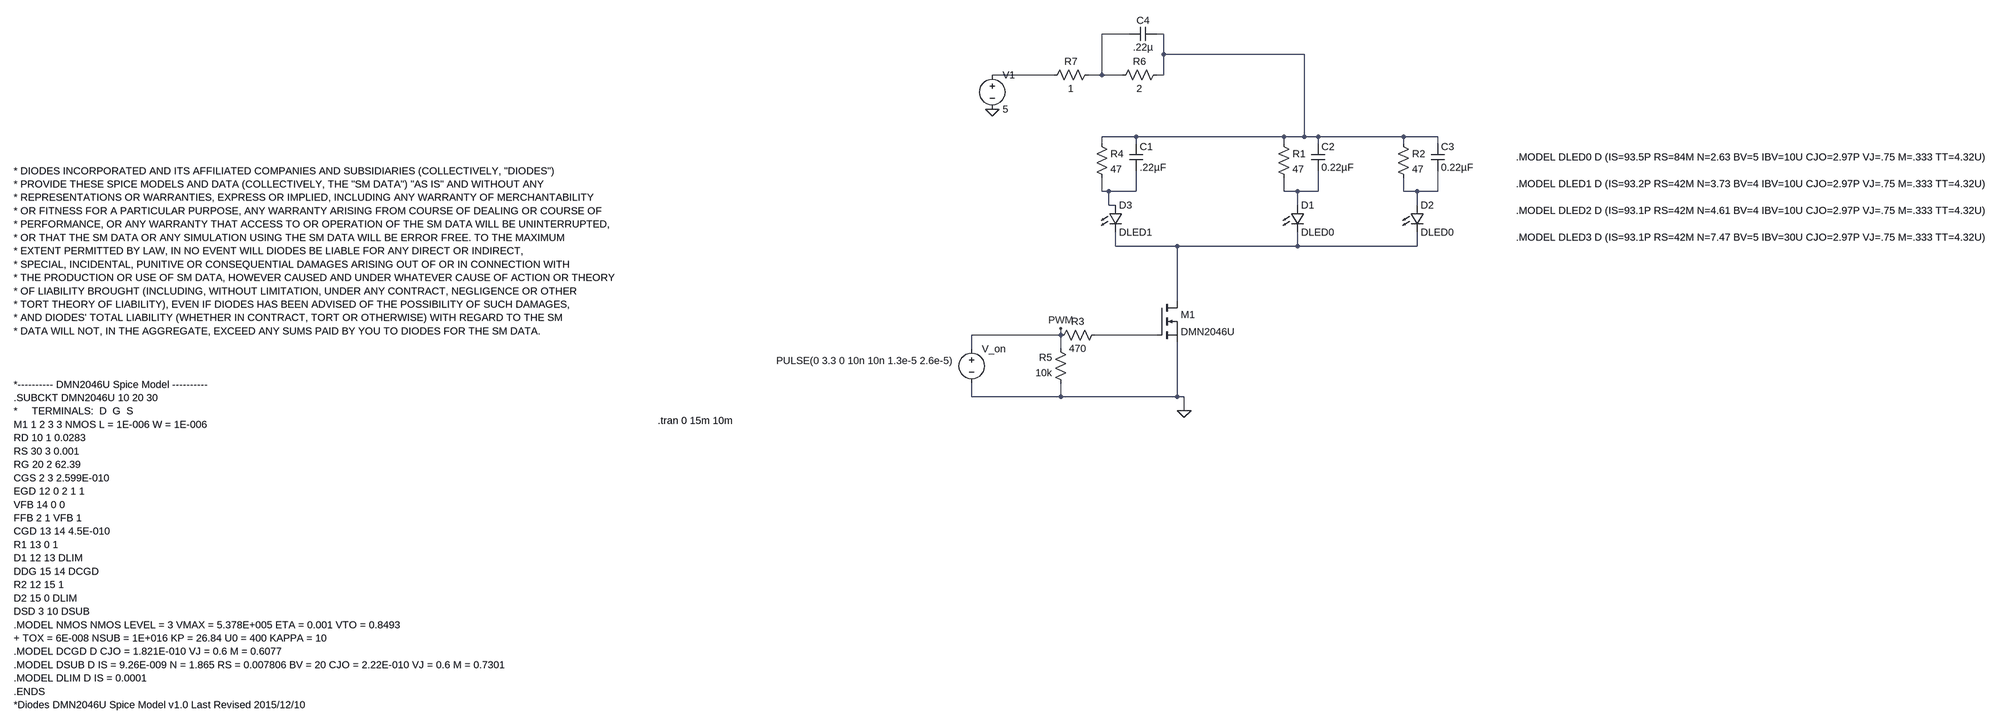
[diagram p0: schematic sim.asc]
sim.asc, the LTspice schematic file:
Version 4
SHEET 1 2612 976
WIRE 96 -480 32 -480
WIRE 176 -480 160 -480
WIRE 176 -432 176 -480
WIRE 528 -432 176 -432
WIRE -80 -384 -224 -384
WIRE 32 -384 32 -480
WIRE 32 -384 0 -384
WIRE 80 -384 32 -384
WIRE 176 -384 176 -432
WIRE 176 -384 160 -384
WIRE 112 -240 32 -240
WIRE 480 -240 112 -240
WIRE 528 -240 528 -432
WIRE 528 -240 480 -240
WIRE 560 -240 528 -240
WIRE 816 -240 560 -240
WIRE 896 -240 816 -240
WIRE 32 -224 32 -240
WIRE 112 -224 112 -240
WIRE 480 -224 480 -240
WIRE 560 -224 560 -240
WIRE 816 -224 816 -240
WIRE 896 -224 896 -240
WIRE 32 -112 32 -144
WIRE 48 -112 32 -112
WIRE 112 -112 112 -160
WIRE 112 -112 48 -112
WIRE 480 -112 480 -144
WIRE 512 -112 480 -112
WIRE 560 -112 560 -160
WIRE 560 -112 512 -112
WIRE 816 -112 816 -144
WIRE 848 -112 816 -112
WIRE 896 -112 896 -160
WIRE 896 -112 848 -112
WIRE 48 -80 48 -112
WIRE 64 -80 48 -80
WIRE 512 -80 512 -112
WIRE 848 -80 848 -112
WIRE 64 16 64 -16
WIRE 208 16 64 16
WIRE 512 16 512 -16
WIRE 512 16 208 16
WIRE 848 16 848 -16
WIRE 848 16 512 16
WIRE 208 144 208 16
WIRE -64 224 -64 208
WIRE -64 224 -272 224
WIRE 160 224 16 224
WIRE -272 256 -272 224
WIRE -64 256 -64 224
WIRE -272 368 -272 336
WIRE -64 368 -64 336
WIRE -64 368 -272 368
WIRE 208 368 208 240
WIRE 208 368 -64 368
WIRE 224 368 208 368
WIRE 224 400 224 368
FLAG 224 400 0
FLAG -224 -304 0
FLAG -64 208 PWM
SYMBOL res 464 -240 R0
SYMATTR InstName R1
SYMATTR Value 47
SYMBOL voltage -224 -400 R0
WINDOW 123 0 0 Left 0
WINDOW 39 0 0 Left 0
SYMATTR InstName V1
SYMATTR Value 5
SYMBOL res 32 208 R90
WINDOW 0 0 56 VBottom 2
WINDOW 3 32 56 VTop 2
SYMATTR InstName R3
SYMATTR Value 470
SYMBOL voltage -272 240 R0
WINDOW 3 -456 44 Left 2
WINDOW 123 0 0 Left 0
WINDOW 39 0 0 Left 0
SYMATTR Value PULSE(0 3.3 0 10n 10n 1.3e-5 2.6e-5)
SYMATTR InstName V_on
SYMBOL res 800 -240 R0
SYMATTR InstName R2
SYMATTR Value 47
SYMBOL LED 832 -80 R0
SYMATTR InstName D2
SYMATTR Value DLED0
SYMATTR Description Diode
SYMATTR Type diode
SYMBOL res 16 -240 R0
SYMATTR InstName R4
SYMATTR Value 47
SYMBOL res -48 352 R180
WINDOW 0 36 76 Left 2
WINDOW 3 36 40 Left 2
SYMATTR InstName R5
SYMATTR Value 10k
SYMBOL cap 96 -224 R0
SYMATTR InstName C1
SYMATTR Value .22µF
SYMBOL cap 544 -224 R0
SYMATTR InstName C2
SYMATTR Value 0.22µF
SYMBOL cap 880 -224 R0
SYMATTR InstName C3
SYMATTR Value 0.22µF
SYMBOL res 176 -400 R90
WINDOW 0 0 56 VBottom 2
WINDOW 3 32 56 VTop 2
SYMATTR InstName R6
SYMATTR Value 2
SYMBOL cap 160 -496 R90
WINDOW 0 0 32 VBottom 2
WINDOW 3 32 32 VTop 2
SYMATTR InstName C4
SYMATTR Value .22µ
SYMBOL res 16 -400 R90
WINDOW 0 0 56 VBottom 2
WINDOW 3 32 56 VTop 2
SYMATTR InstName R7
SYMATTR Value 1
SYMBOL nmos 160 144 R0
SYMATTR InstName M1
SYMATTR Value DMN2046U
SYMATTR Prefix X
SYMATTR SpiceModel DMN2046U
SYMBOL LED 496 -80 R0
SYMATTR InstName D1
SYMATTR Value DLED0
SYMATTR Description Diode
SYMATTR Type diode
SYMBOL LED 48 -80 R0
SYMATTR InstName D3
SYMATTR Value DLED1
SYMATTR Description Diode
SYMATTR Type diode
TEXT -1128 424 Left 2 !.tran 0 15m 10m
TEXT -3128 -160 Left 2 !* DIODES INCORPORATED AND ITS AFFILIATED COMPANIES AND SUBSIDIARIES (COLLECTIVELY, "DIODES") \n* PROVIDE THESE SPICE MODELS AND DATA (COLLECTIVELY, THE "SM DATA") "AS IS" AND WITHOUT ANY \n* REPRESENTATIONS OR WARRANTIES, EXPRESS OR IMPLIED, INCLUDING ANY WARRANTY OF MERCHANTABILITY \n* OR FITNESS FOR A PARTICULAR PURPOSE, ANY WARRANTY ARISING FROM COURSE OF DEALING OR COURSE OF \n* PERFORMANCE, OR ANY WARRANTY THAT ACCESS TO OR OPERATION OF THE SM DATA WILL BE UNINTERRUPTED, \n* OR THAT THE SM DATA OR ANY SIMULATION USING THE SM DATA WILL BE ERROR FREE. TO THE MAXIMUM \n* EXTENT PERMITTED BY LAW, IN NO EVENT WILL DIODES BE LIABLE FOR ANY DIRECT OR INDIRECT, \n* SPECIAL, INCIDENTAL, PUNITIVE OR CONSEQUENTIAL DAMAGES ARISING OUT OF OR IN CONNECTION WITH \n* THE PRODUCTION OR USE OF SM DATA, HOWEVER CAUSED AND UNDER WHATEVER CAUSE OF ACTION OR THEORY \n* OF LIABILITY BROUGHT (INCLUDING, WITHOUT LIMITATION, UNDER ANY CONTRACT, NEGLIGENCE OR OTHER \n* TORT THEORY OF LIABILITY), EVEN IF DIODES HAS BEEN ADVISED OF THE POSSIBILITY OF SUCH DAMAGES, \n* AND DIODES' TOTAL LIABILITY (WHETHER IN CONTRACT, TORT OR OTHERWISE) WITH REGARD TO THE SM \n* DATA WILL NOT, IN THE AGGREGATE, EXCEED ANY SUMS PAID BY YOU TO DIODES FOR THE SM DATA.\n \n \n \n*---------- DMN2046U Spice Model ----------\n.SUBCKT DMN2046U 10 20 30 \n*     TERMINALS:  D  G  S\nM1 1 2 3 3 NMOS L = 1E-006 W = 1E-006 \nRD 10 1 0.0283 \nRS 30 3 0.001 \nRG 20 2 62.39 \nCGS 2 3 2.599E-010 \nEGD 12 0 2 1 1 \nVFB 14 0 0 \nFFB 2 1 VFB 1 \nCGD 13 14 4.5E-010 \nR1 13 0 1 \nD1 12 13 DLIM \nDDG 15 14 DCGD \nR2 12 15 1 \nD2 15 0 DLIM \nDSD 3 10 DSUB \n.MODEL NMOS NMOS LEVEL = 3 VMAX = 5.378E+005 ETA = 0.001 VTO = 0.8493 \n+ TOX = 6E-008 NSUB = 1E+016 KP = 26.84 U0 = 400 KAPPA = 10 \n.MODEL DCGD D CJO = 1.821E-010 VJ = 0.6 M = 0.6077 \n.MODEL DSUB D IS = 9.26E-009 N = 1.865 RS = 0.007806 BV = 20 CJO = 2.22E-010 VJ = 0.6 M = 0.7301 \n.MODEL DLIM D IS = 0.0001 \n.ENDS\n*Diodes DMN2046U Spice Model v1.0 Last Revised 2015/12/10
TEXT 1152 -192 Left 2 !.MODEL DLED0 D (IS=93.5P RS=84M N=2.63 BV=5 IBV=10U CJO=2.97P VJ=.75 M=.333 TT=4.32U)\n \n.MODEL DLED1 D (IS=93.2P RS=42M N=3.73 BV=4 IBV=10U CJO=2.97P VJ=.75 M=.333 TT=4.32U)\n \n.MODEL DLED2 D (IS=93.1P RS=42M N=4.61 BV=4 IBV=10U CJO=2.97P VJ=.75 M=.333 TT=4.32U)\n \n.MODEL DLED3 D (IS=93.1P RS=42M N=7.47 BV=5 IBV=30U CJO=2.97P VJ=.75 M=.333 TT=4.32U)

The netlist it stands for:
* sim.asc
R1 N002 N005 47
V1 N003 0 5
R3 N008 PWM 470
V_on PWM 0 PULSE(0 3.3 0 10n 10n 1.3e-5 2.6e-5)
R2 N002 N006 47
D2 N006 N007 DLED0
R4 N002 N004 47
R5 0 PWM 10k
C1 N002 N004 .22µF
C2 N002 N005 0.22µF
C3 N002 N006 0.22µF
R6 N002 N001 2
C4 N002 N001 .22µ
R7 N001 N003 1
XM1 N007 N008 0 DMN2046U DMN2046U  ; pins D G S
D1 N005 N007 DLED0
D3 N004 N007 DLED1
.model D D
.lib standard.dio
.tran 0 15m 10m
* DIODES INCORPORATED AND ITS AFFILIATED COMPANIES AND SUBSIDIARIES (COLLECTIVELY, "DIODES")
* PROVIDE THESE SPICE MODELS AND DATA (COLLECTIVELY, THE "SM DATA") "AS IS" AND WITHOUT ANY
* REPRESENTATIONS OR WARRANTIES, EXPRESS OR IMPLIED, INCLUDING ANY WARRANTY OF MERCHANTABILITY
* OR FITNESS FOR A PARTICULAR PURPOSE, ANY WARRANTY ARISING FROM COURSE OF DEALING OR COURSE OF
* PERFORMANCE, OR ANY WARRANTY THAT ACCESS TO OR OPERATION OF THE SM DATA WILL BE UNINTERRUPTED,
* OR THAT THE SM DATA OR ANY SIMULATION USING THE SM DATA WILL BE ERROR FREE. TO THE MAXIMUM
* EXTENT PERMITTED BY LAW, IN NO EVENT WILL DIODES BE LIABLE FOR ANY DIRECT OR INDIRECT,
* SPECIAL, INCIDENTAL, PUNITIVE OR CONSEQUENTIAL DAMAGES ARISING OUT OF OR IN CONNECTION WITH
* THE PRODUCTION OR USE OF SM DATA, HOWEVER CAUSED AND UNDER WHATEVER CAUSE OF ACTION OR THEORY
* OF LIABILITY BROUGHT (INCLUDING, WITHOUT LIMITATION, UNDER ANY CONTRACT, NEGLIGENCE OR OTHER
* TORT THEORY OF LIABILITY), EVEN IF DIODES HAS BEEN ADVISED OF THE POSSIBILITY OF SUCH DAMAGES,
* AND DIODES' TOTAL LIABILITY (WHETHER IN CONTRACT, TORT OR OTHERWISE) WITH REGARD TO THE SM
* DATA WILL NOT, IN THE AGGREGATE, EXCEED ANY SUMS PAID BY YOU TO DIODES FOR THE SM DATA.
*---------- DMN2046U Spice Model ----------
.SUBCKT DMN2046U 10 20 30
*     TERMINALS:  D  G  S
M1 1 2 3 3 NMOS L = 1E-006 W = 1E-006
RD 10 1 0.0283
RS 30 3 0.001
RG 20 2 62.39
CGS 2 3 2.599E-010
EGD 12 0 2 1 1
VFB 14 0 0
FFB 2 1 VFB 1
CGD 13 14 4.5E-010
R1 13 0 1
D1 12 13 DLIM
DDG 15 14 DCGD
R2 12 15 1
D2 15 0 DLIM
DSD 3 10 DSUB
.MODEL NMOS NMOS LEVEL = 3 VMAX = 5.378E+005 ETA = 0.001 VTO = 0.8493
+ TOX = 6E-008 NSUB = 1E+016 KP = 26.84 U0 = 400 KAPPA = 10
.MODEL DCGD D CJO = 1.821E-010 VJ = 0.6 M = 0.6077
.MODEL DSUB D IS = 9.26E-009 N = 1.865 RS = 0.007806 BV = 20 CJO = 2.22E-010 VJ = 0.6 M = 0.7301
.MODEL DLIM D IS = 0.0001
.ENDS
*Diodes DMN2046U Spice Model v1.0 Last Revised 2015/12/10
.MODEL DLED0 D (IS=93.5P RS=84M N=2.63 BV=5 IBV=10U CJO=2.97P VJ=.75 M=.333 TT=4.32U)
.MODEL DLED1 D (IS=93.2P RS=42M N=3.73 BV=4 IBV=10U CJO=2.97P VJ=.75 M=.333 TT=4.32U)
.MODEL DLED2 D (IS=93.1P RS=42M N=4.61 BV=4 IBV=10U CJO=2.97P VJ=.75 M=.333 TT=4.32U)
.MODEL DLED3 D (IS=93.1P RS=42M N=7.47 BV=5 IBV=30U CJO=2.97P VJ=.75 M=.333 TT=4.32U)
.backanno
.end